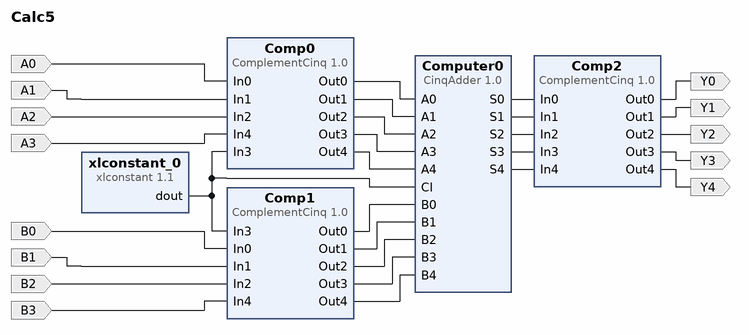
[diagram p0: block diagram of the top level]
# Vivado block design Calc5, xc7a35tcpg236-1, Vivado 2017.2
create_bd_design Calc5

create_bd_port -dir I A0
create_bd_port -dir I A1
create_bd_port -dir I A2
create_bd_port -dir I A3
create_bd_port -dir I B0
create_bd_port -dir I B1
create_bd_port -dir I B2
create_bd_port -dir I B3
create_bd_port -dir O Y0
create_bd_port -dir O Y1
create_bd_port -dir O Y2
create_bd_port -dir O Y3
create_bd_port -dir O Y4

create_bd_cell -type ip -vlnv xilinx.com:user:ComplementCinq:1.0 Comp0
create_bd_cell -type ip -vlnv xilinx.com:user:ComplementCinq:1.0 Comp1
create_bd_cell -type ip -vlnv xilinx.com:user:ComplementCinq:1.0 Comp2
create_bd_cell -type ip -vlnv xilinx.com:user:CinqAdder:1.0 Computer0
create_bd_cell -type ip -vlnv xilinx.com:ip:xlconstant:1.1 xlconstant_0
set_property -dict {CONFIG.CONST_VAL 0} [get_bd_cells xlconstant_0]

# ---- connections ----

connect_bd_net [get_bd_pins Comp0/Out0] [get_bd_pins Computer0/A0]
connect_bd_net [get_bd_pins Comp0/Out1] [get_bd_pins Computer0/A1]
connect_bd_net [get_bd_pins Comp0/Out2] [get_bd_pins Computer0/A2]
connect_bd_net [get_bd_pins Comp0/Out3] [get_bd_pins Computer0/A3]
connect_bd_net [get_bd_pins Comp0/Out4] [get_bd_pins Computer0/A4]
connect_bd_net [get_bd_pins Comp1/Out0] [get_bd_pins Computer0/B0]
connect_bd_net [get_bd_pins Comp1/Out1] [get_bd_pins Computer0/B1]
connect_bd_net [get_bd_pins Comp1/Out2] [get_bd_pins Computer0/B2]
connect_bd_net [get_bd_pins Comp1/Out3] [get_bd_pins Computer0/B3]
connect_bd_net [get_bd_pins Comp1/Out4] [get_bd_pins Computer0/B4]
connect_bd_net [get_bd_pins xlconstant_0/dout] [get_bd_pins Comp0/In3] [get_bd_pins Comp1/In3] [get_bd_pins Computer0/CI]
connect_bd_net [get_bd_pins Computer0/S0] [get_bd_pins Comp2/In0]
connect_bd_net [get_bd_pins Computer0/S1] [get_bd_pins Comp2/In1]
connect_bd_net [get_bd_pins Computer0/S2] [get_bd_pins Comp2/In2]
connect_bd_net [get_bd_pins Computer0/S3] [get_bd_pins Comp2/In3]
connect_bd_net [get_bd_pins Computer0/S4] [get_bd_pins Comp2/In4]
connect_bd_net -net A0_1 [get_bd_ports A0] [get_bd_pins Comp0/In0]
connect_bd_net -net A1_1 [get_bd_ports A1] [get_bd_pins Comp0/In1]
connect_bd_net -net A2_1 [get_bd_ports A2] [get_bd_pins Comp0/In2]
connect_bd_net -net A3_1 [get_bd_ports A3] [get_bd_pins Comp0/In4]
connect_bd_net -net B0_1 [get_bd_ports B0] [get_bd_pins Comp1/In0]
connect_bd_net -net B1_1 [get_bd_ports B1] [get_bd_pins Comp1/In1]
connect_bd_net -net B2_1 [get_bd_ports B2] [get_bd_pins Comp1/In2]
connect_bd_net -net B3_1 [get_bd_ports B3] [get_bd_pins Comp1/In4]
connect_bd_net [get_bd_pins Comp2/Out0] [get_bd_ports Y0]
connect_bd_net [get_bd_pins Comp2/Out1] [get_bd_ports Y1]
connect_bd_net [get_bd_pins Comp2/Out2] [get_bd_ports Y2]
connect_bd_net [get_bd_pins Comp2/Out3] [get_bd_ports Y3]
connect_bd_net [get_bd_pins Comp2/Out4] [get_bd_ports Y4]

validate_bd_design
save_bd_design
